# EAGLE schematic Minisumo_V1 (EAGLE 9.6.2)

## Sheet 1 of 6: TOF
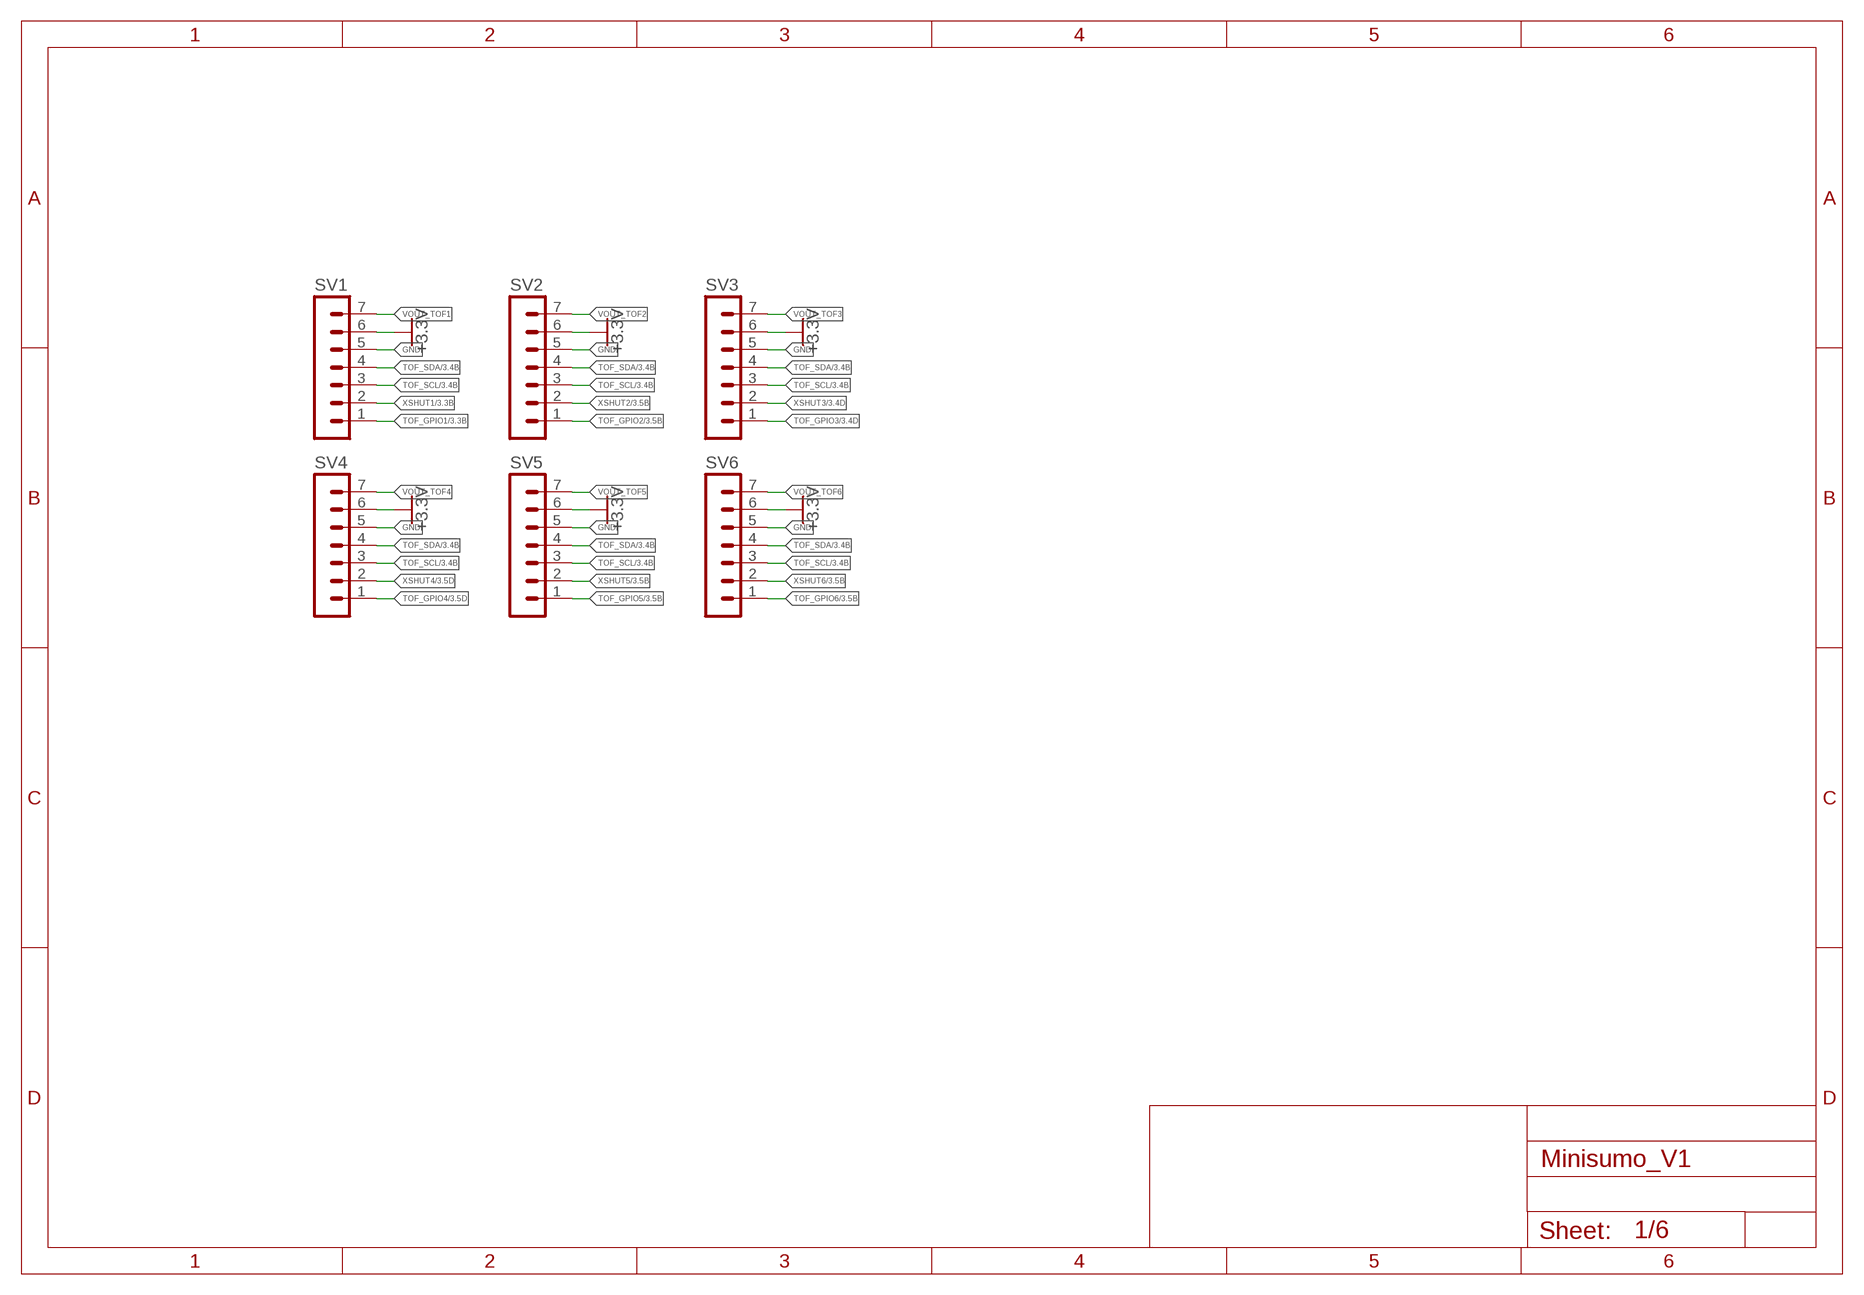
[diagram p0: schematic, sheet 1]

### Parts
SV1  MA07-1  [MA07-1]
SV2  MA07-1  [MA07-1]
SV3  MA07-1  [MA07-1]
SV4  MA07-1  [MA07-1]
SV5  MA07-1  [MA07-1]
SV6  MA07-1  [MA07-1]

### Nets
+3.3V: SV1.6 SV2.6 SV3.6 SV4.6 SV5.6 SV6.6 ; also sheet 2,3,4,5,6
GND: SV1.5 SV2.5 SV3.5 SV4.5 SV5.5 SV6.5 ; also sheet 2,3,4,5,6
TOF_GPIO1: SV1.1 ; also sheet 3
TOF_GPIO2: SV2.1 ; also sheet 3
TOF_GPIO3: SV3.1 ; also sheet 3
TOF_GPIO4: SV4.1 ; also sheet 3
TOF_GPIO5: SV5.1 ; also sheet 3
TOF_GPIO6: SV6.1 ; also sheet 3
TOF_SCL: SV1.3 SV2.3 SV3.3 SV4.3 SV5.3 SV6.3 ; also sheet 3
TOF_SDA: SV1.4 SV2.4 SV3.4 SV4.4 SV5.4 SV6.4 ; also sheet 3
VOUT_TOF1: SV1.7
VOUT_TOF2: SV2.7
VOUT_TOF3: SV3.7
VOUT_TOF4: SV4.7
VOUT_TOF5: SV5.7
VOUT_TOF6: SV6.7
XSHUT1: SV1.2 ; also sheet 3
XSHUT2: SV2.2 ; also sheet 3
XSHUT3: SV3.2 ; also sheet 3
XSHUT4: SV4.2 ; also sheet 3
XSHUT5: SV5.2 ; also sheet 3
XSHUT6: SV6.2 ; also sheet 3

## Sheet 2 of 6: Power
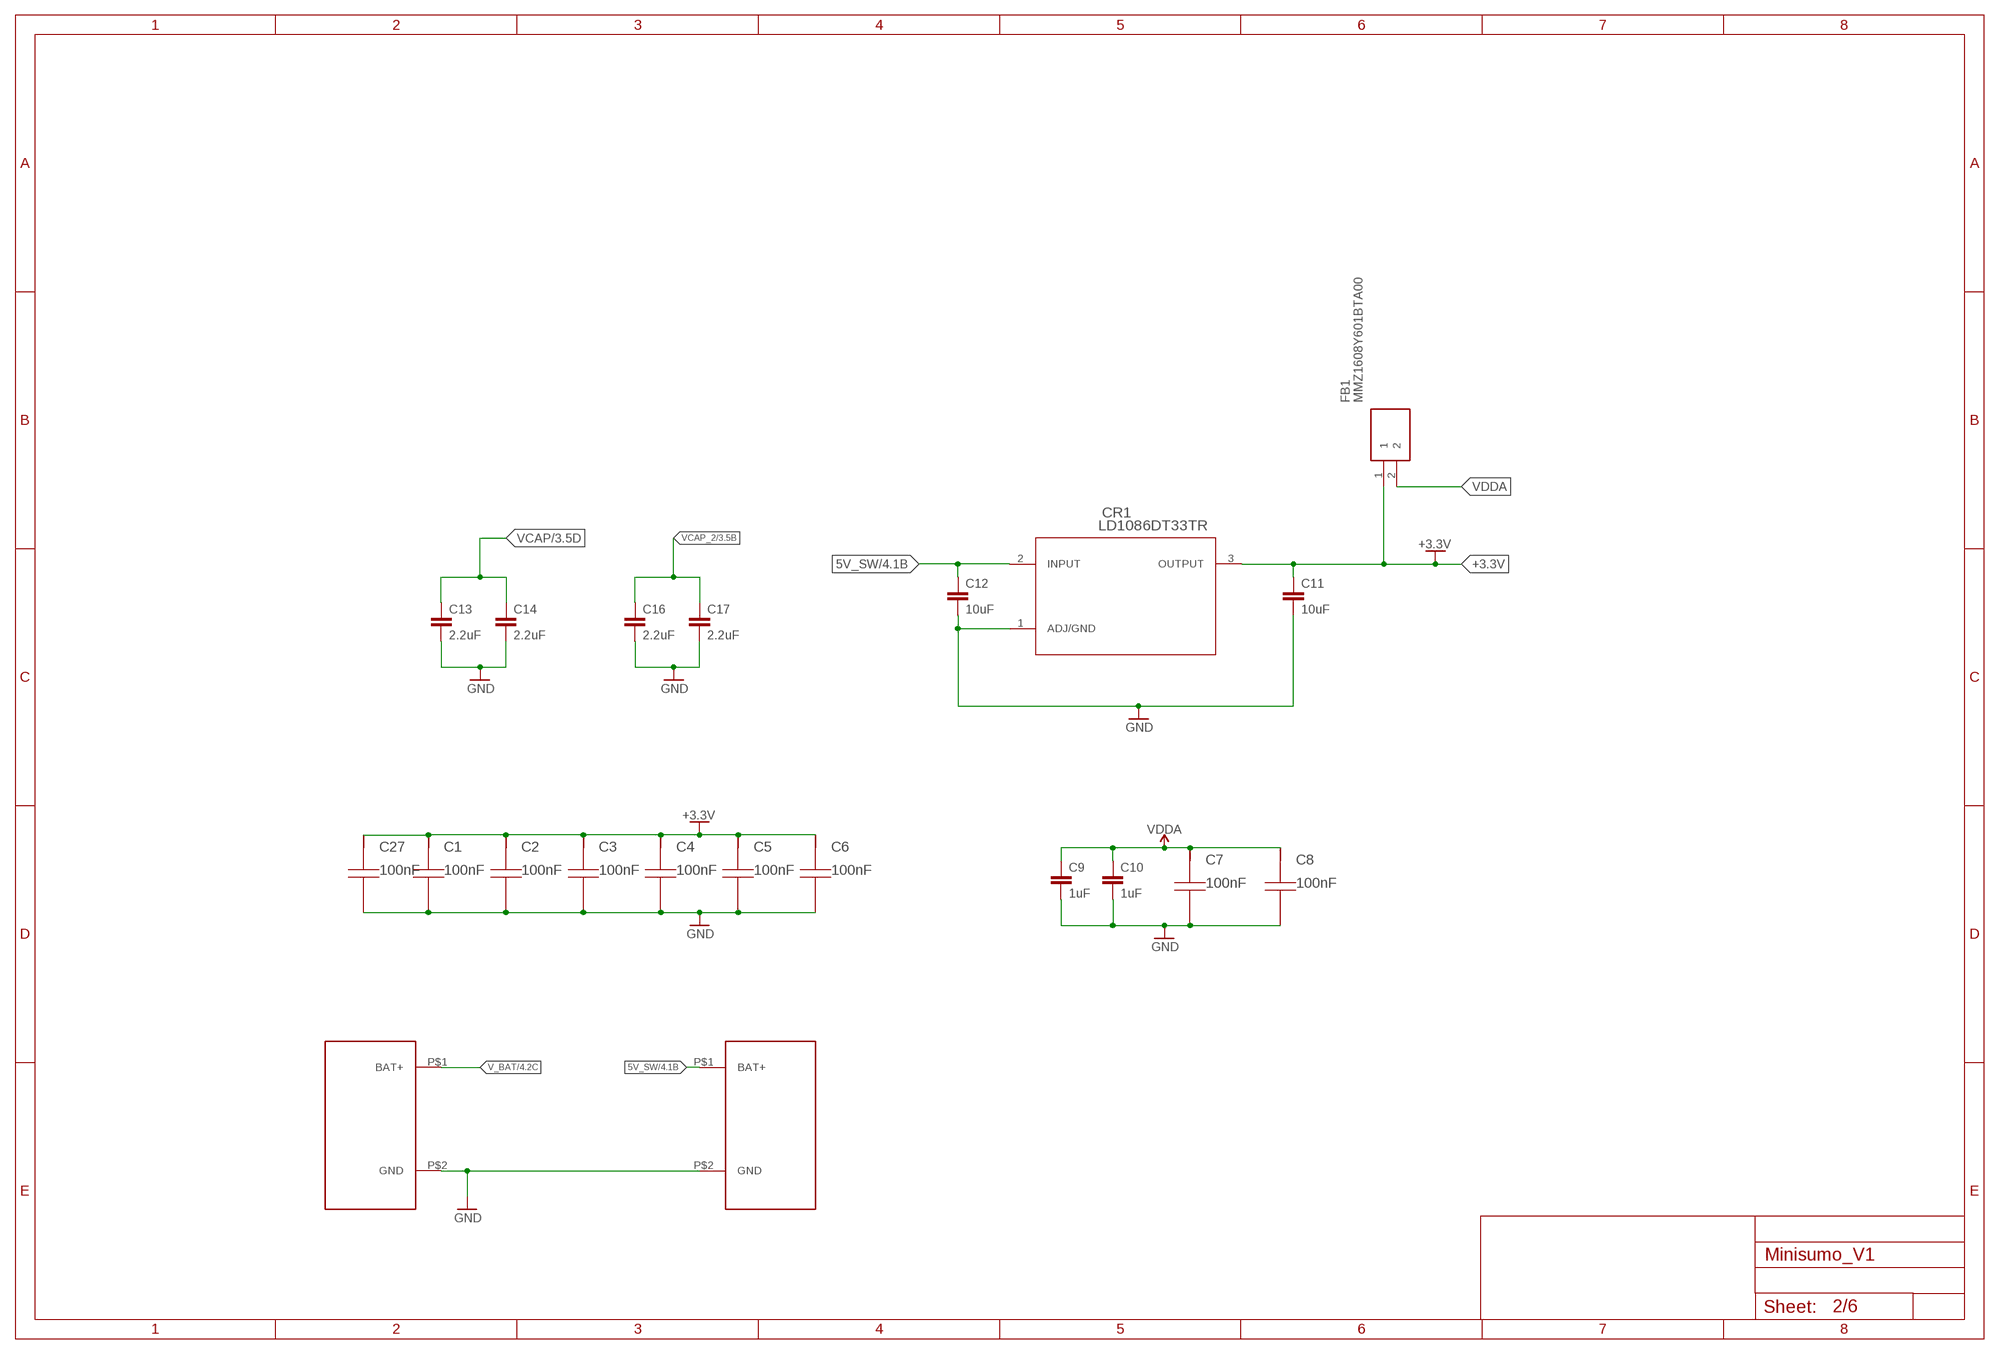
[diagram p1: schematic, sheet 2]

### Parts
C1  100nF  GRM155R71C104KA88D0402  [C0402]
C2  100nF  GRM155R71C104KA88D0402  [C0402]
C3  100nF  GRM155R71C104KA88D0402  [C0402]
C4  100nF  GRM155R71C104KA88D0402  [C0402]
C5  100nF  GRM155R71C104KA88D0402  [C0402]
C6  100nF  GRM155R71C104KA88D0402  [C0402]
C7  100nF  GRM155R71C104KA88D0402  [C0402]
C8  100nF  GRM155R71C104KA88D0402  [C0402]
C9  1uF  C-EUC0402  [C0402]
C10  1uF  C-EUC0402  [C0402]
C11  10uF  C-EUC0603  [C0603]
C12  10uF  C-EUC0603  [C0603]
C13  2.2uF  C-EUC0603  [C0603]
C14  2.2uF  C-EUC0603  [C0603]
C16  2.2uF  C-EUC0603  [C0603]
C17  2.2uF  C-EUC0603  [C0603]
C27  100nF  GRM155R71C104KA88D0402  [C0402]
CR1  LD1086DT33TR  [D2PAK_STM]
FB1  MMZ1608Y601BTA00  [BEADC1608X95N]
U$6  BAT_POW  [BAT_POW]
U$7  BAT_POW  [BAT_POW]

### Nets
5V_SW: C12.1 CR1.2(INPUT) U$7.P$1(BAT+) ; also sheet 4
+3.3V: C1.1 C2.1 C3.1 C4.1 C5.1 C6.1 C11.1 C27.1 CR1.3(OUTPUT) FB1.1 ; also sheet 1,3,4,5,6
GND: C1.2 C2.2 C3.2 C4.2 C5.2 C6.2 C7.2 C8.2 C9.2 C10.2 C11.2 C12.2 C13.2 C14.2 C16.2 C17.2 C27.2 CR1.1(ADJ/GND) U$6.P$2(GND) U$7.P$2(GND) ; also sheet 1,3,4,5,6
V_BAT: U$6.P$1(BAT+) ; also sheet 4
VCAP: C13.1 C14.1 ; also sheet 3
VCAP_2: C16.1 C17.1 ; also sheet 3
VDDA: C7.1 C8.1 C9.1 C10.1 FB1.2 ; also sheet 3

## Sheet 3 of 6: MCU
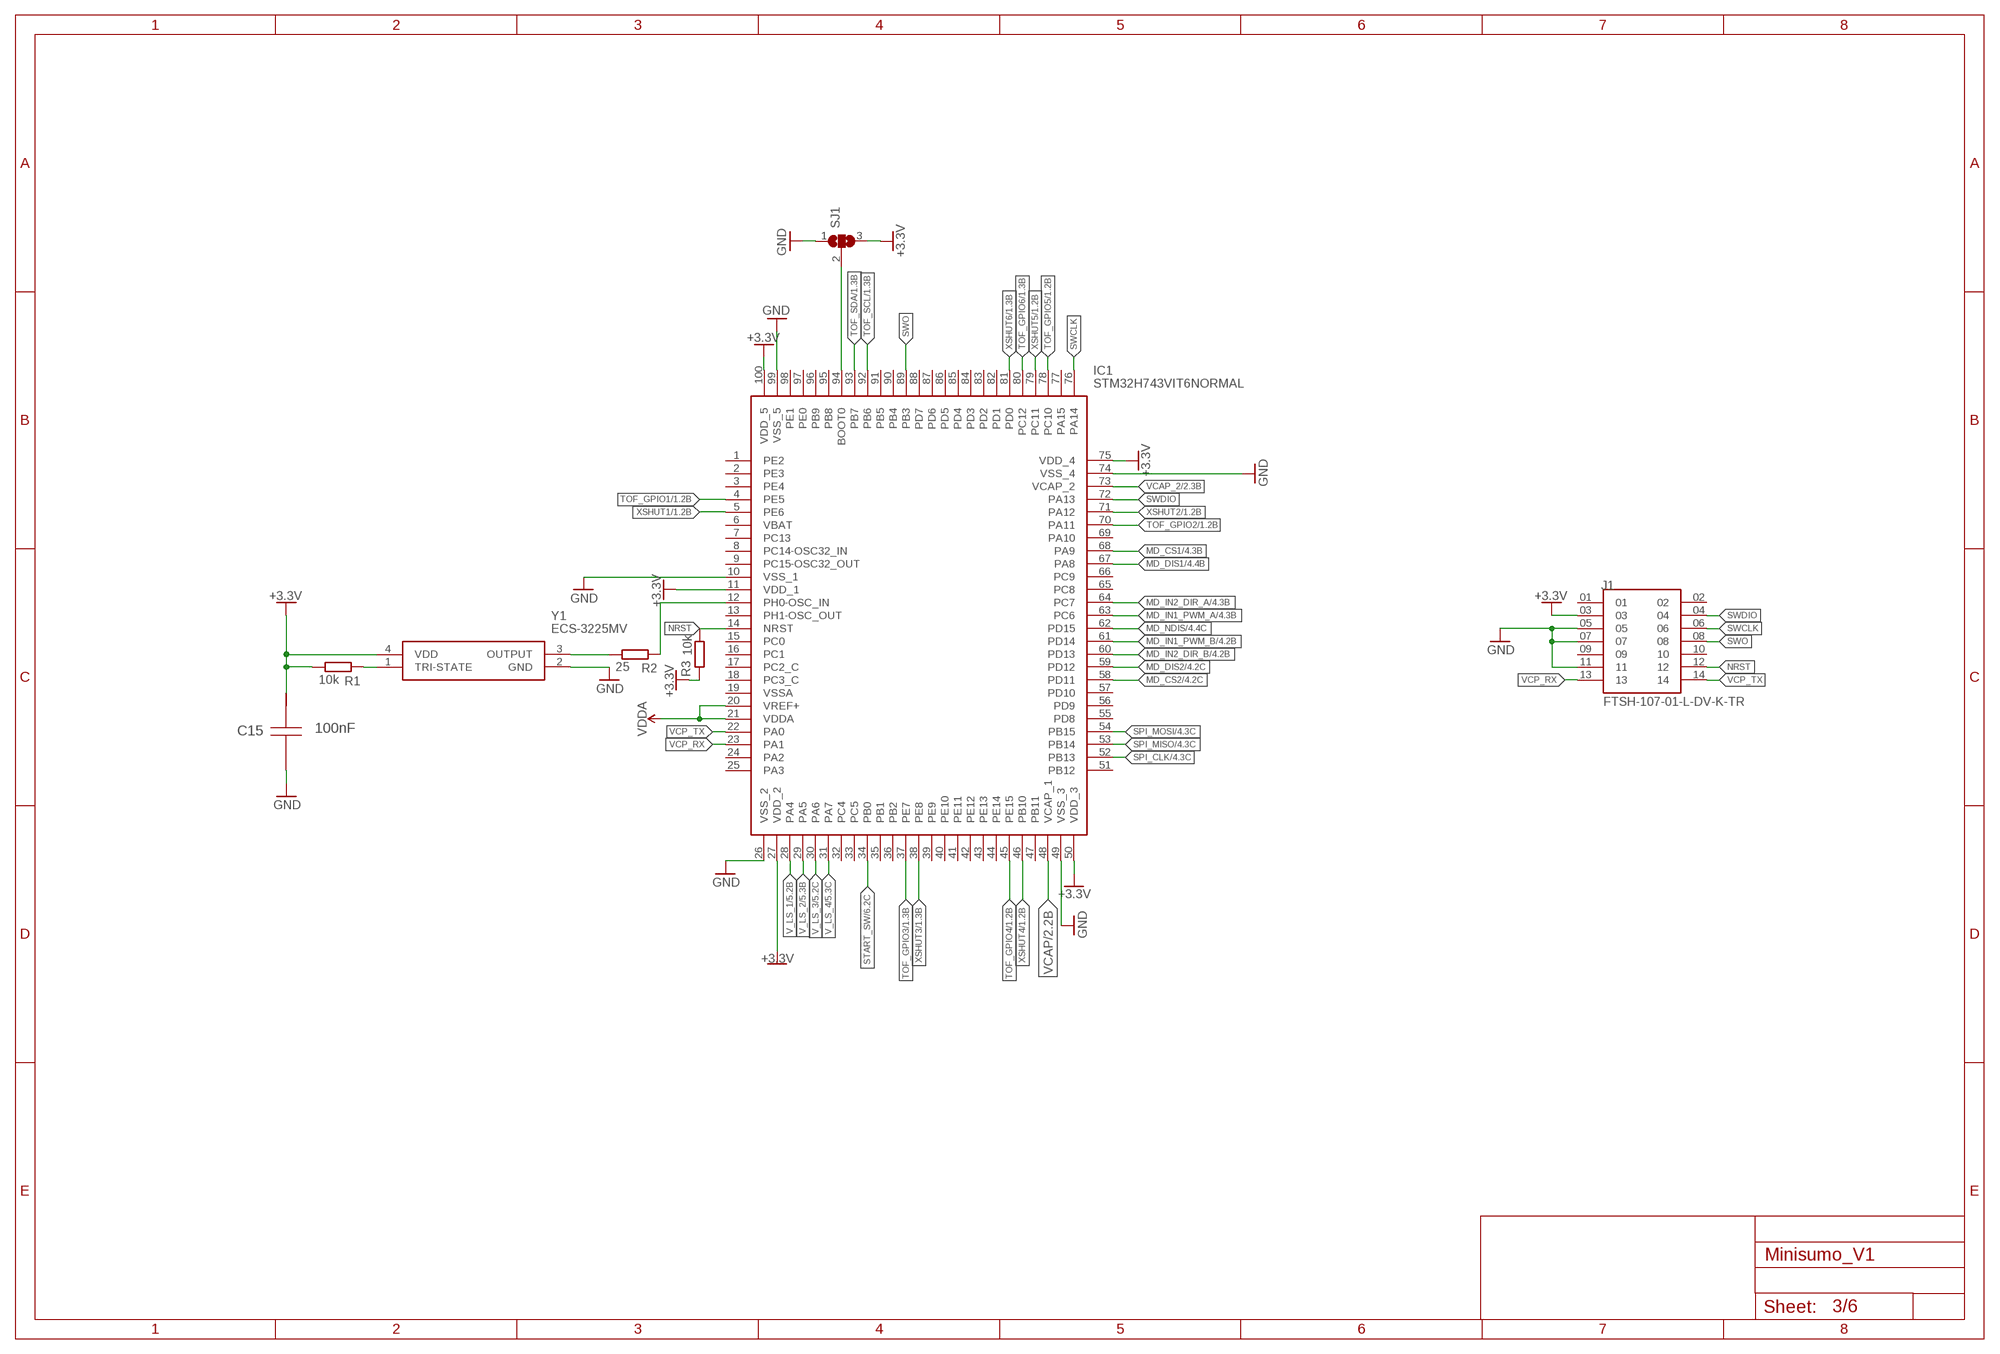
[diagram p2: schematic, sheet 3]

### Parts
C15  100nF  GRM155R71C104KA88D0402  [C0402]
IC1  STM32H743VIT6NORMAL  [QFP50P1600X1600X160-100N]
J1  FTSH-107-01-L-DV-K-TR  [SAMTEC_FTSH-107-01-L-DV-K-TR]
R1  10k  R-EU_R0402  [R0402]
R2  25  R-EU_R0402  [R0402]
R3  10k  R-EU_R0402  [R0402]
SJ1  SJ2W  [SJ_2]
Y1  ECS-3225MV  [ECS3225MV]

### Nets
+3.3V: C15.1 IC1.11(VDD_1) IC1.27(VDD_2) IC1.50(VDD_3) IC1.75(VDD_4) IC1.100(VDD_5) J1.03 R1.1 R3.2 SJ1.3 Y1.4(VDD) ; also sheet 1,2,4,5,6
GND: C15.2 IC1.10(VSS_1) IC1.26(VSS_2) IC1.49(VSS_3) IC1.74(VSS_4) IC1.99(VSS_5) J1.05 J1.07 J1.11 SJ1.1 Y1.2(GND) ; also sheet 1,2,4,5,6
MD_CS1: IC1.68(PA9) ; also sheet 4
MD_CS2: IC1.58(PD11) ; also sheet 4
MD_DIS1: IC1.67(PA8) ; also sheet 4
MD_DIS2: IC1.59(PD12) ; also sheet 4
MD_IN1_PWM_A: IC1.63(PC6) ; also sheet 4
MD_IN1_PWM_B: IC1.61(PD14) ; also sheet 4
MD_IN2_DIR_A: IC1.64(PC7) ; also sheet 4
MD_IN2_DIR_B: IC1.60(PD13) ; also sheet 4
MD_NDIS: IC1.62(PD15) ; also sheet 4
N$1: IC1.94(BOOT0) SJ1.2
N$2: R2.1 Y1.3(OUTPUT)
N$3: R1.2 Y1.1(TRI-STATE)
N$4: IC1.12(PH0-OSC_IN) R2.2
NRST: IC1.14(NRST) J1.12 R3.1
SPI_CLK: IC1.52(PB13) ; also sheet 4
SPI_MISO: IC1.53(PB14) ; also sheet 4
SPI_MOSI: IC1.54(PB15) ; also sheet 4
START_SW: IC1.34(PB0) ; also sheet 6
SWCLK: IC1.76(PA14) J1.06
SWDIO: IC1.72(PA13) J1.04
SWO: IC1.89(PB3) J1.08
TOF_GPIO1: IC1.4(PE5) ; also sheet 1
TOF_GPIO2: IC1.70(PA11) ; also sheet 1
TOF_GPIO3: IC1.37(PE7) ; also sheet 1
TOF_GPIO4: IC1.45(PE15) ; also sheet 1
TOF_GPIO5: IC1.78(PC10) ; also sheet 1
TOF_GPIO6: IC1.80(PC12) ; also sheet 1
TOF_SCL: IC1.92(PB6) ; also sheet 1
TOF_SDA: IC1.93(PB7) ; also sheet 1
V_LS_1: IC1.28(PA4) ; also sheet 5
V_LS_2: IC1.29(PA5) ; also sheet 5
V_LS_3: IC1.30(PA6) ; also sheet 5
V_LS_4: IC1.31(PA7) ; also sheet 5
VCAP: IC1.48(VCAP_1) ; also sheet 2
VCAP_2: IC1.73(VCAP_2) ; also sheet 2
VCP_RX: IC1.23(PA1) J1.13
VCP_TX: IC1.22(PA0) J1.14
VDDA: IC1.20(VREF+) IC1.21(VDDA) ; also sheet 2
XSHUT1: IC1.5(PE6) ; also sheet 1
XSHUT2: IC1.71(PA12) ; also sheet 1
XSHUT3: IC1.38(PE8) ; also sheet 1
XSHUT4: IC1.46(PB10) ; also sheet 1
XSHUT5: IC1.79(PC11) ; also sheet 1
XSHUT6: IC1.81(PD0) ; also sheet 1
Unconnected: IC1.1(PE2) IC1.2(PE3) IC1.3(PE4) IC1.6(VBAT) IC1.7(PC13) IC1.8(PC14-OSC32_IN) IC1.9(PC15-OSC32_OUT) IC1.13(PH1-OSC_OUT) IC1.15(PC0) IC1.16(PC1) IC1.17(PC2_C) IC1.18(PC3_C) IC1.19(VSSA) IC1.24(PA2) IC1.25(PA3) IC1.32(PC4) IC1.33(PC5) IC1.35(PB1) IC1.36(PB2) IC1.39(PE9) IC1.40(PE10) IC1.41(PE11) IC1.42(PE12) IC1.43(PE13) IC1.44(PE14) IC1.47(PB11) IC1.51(PB12) IC1.55(PD8) IC1.56(PD9) IC1.57(PD10) IC1.65(PC8) IC1.66(PC9) IC1.69(PA10) IC1.77(PA15) IC1.82(PD1) IC1.83(PD2) IC1.84(PD3) IC1.85(PD4) IC1.86(PD5) IC1.87(PD6) IC1.88(PD7) IC1.90(PB4) IC1.91(PB5) IC1.95(PB8) IC1.96(PB9) IC1.97(PE0) IC1.98(PE1) J1.01 J1.02 J1.09 J1.10

## Sheet 4 of 6: Motor Control
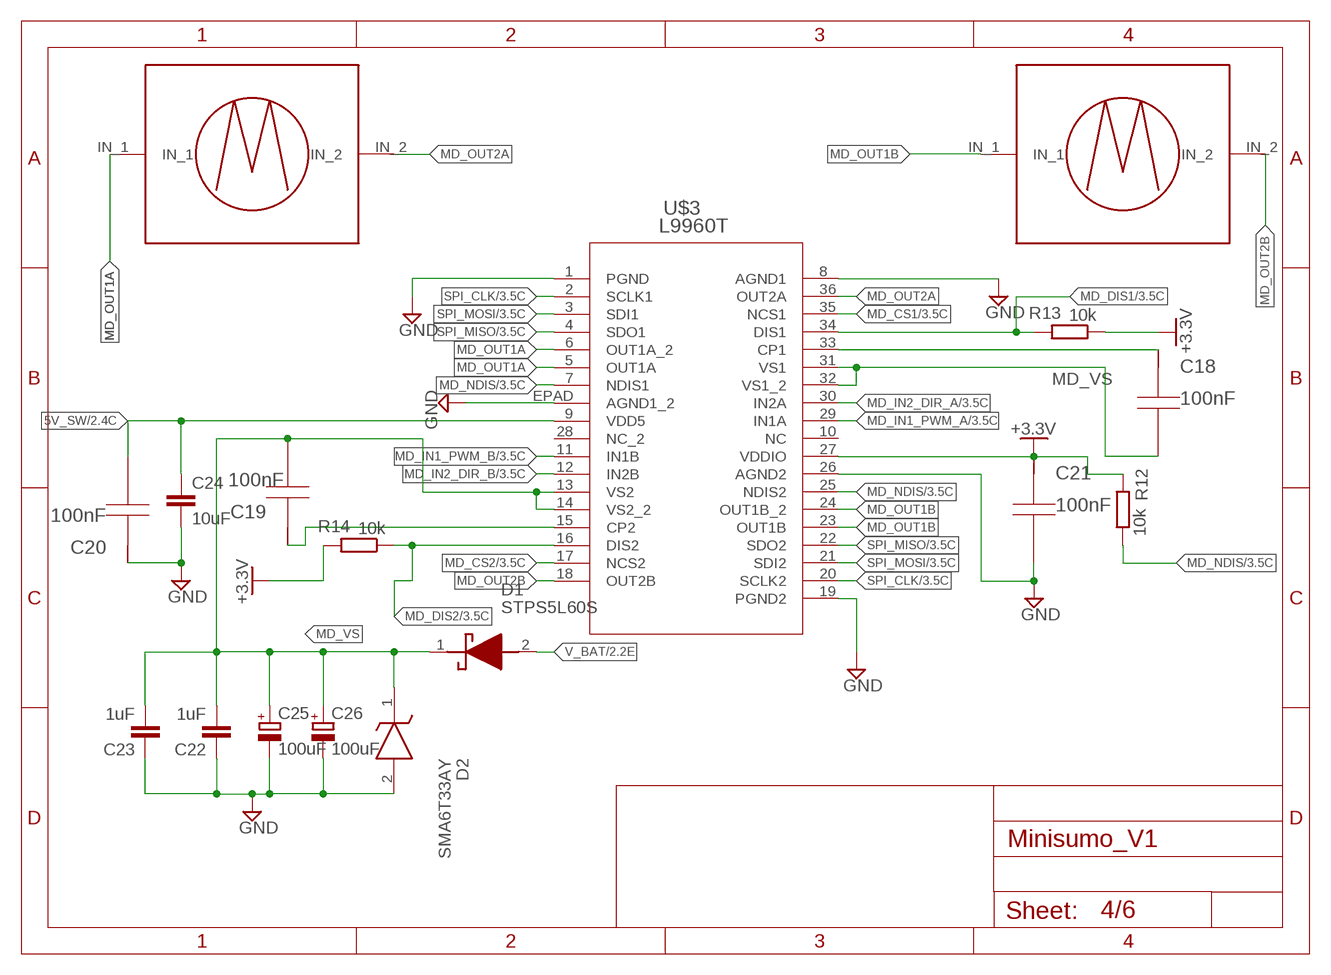
[diagram p3: schematic, sheet 4]

### Parts
C18  100nF  GRM155R71C104KA88D0402  [C0402]
C19  100nF  GRM155R71C104KA88D0402  [C0402]
C20  100nF  GRM155R71C104KA88D0402  [C0402]
C21  100nF  GRM155R71C104KA88D0402  [C0402]
C22  1uF  C-EUC0402  [C0402]
C23  1uF  C-EUC0402  [C0402]
C24  10uF  C-EUC1210  [C1210]
C25  100uF  CPOL-EUUD-8X10  [UD-8X10_NICHICON]
C26  100uF  CPOL-EUUD-8X10  [UD-8X10_NICHICON]
D1  STPS5L60S  [DIOM8059X265N]
D2  SMA6T33AY  [DIOM5126X265N]
R12  10k  R-EU_R0402  [R0402]
R13  10k  R-EU_R0402  [R0402]
R14  10k  R-EU_R0402  [R0402]
U$3  L9960T  [POWERSSO-36_STM]
U$4  MD_OUT  [MD_OUT]
U$5  MD_OUT  [MD_OUT]

### Nets
5V_SW: C20.2 C24.1 U$3.9(VDD5) ; also sheet 2
+3.3V: C21.1 R12.2 R13.1 R14.2 U$3.27(VDDIO) ; also sheet 1,2,3,5,6
GND: C20.1 C21.2 C22.1 C23.1 C24.2 C25.- C26.- D2.2(A) U$3.1(PGND) U$3.8(AGND1) U$3.19(PGND2) U$3.26(AGND2) U$3.EPAD(AGND1_2) ; also sheet 1,2,3,5,6
MD_CS1: U$3.35(NCS1) ; also sheet 3
MD_CS2: U$3.17(NCS2) ; also sheet 3
MD_DIS1: R13.2 U$3.34(DIS1) ; also sheet 3
MD_DIS2: R14.1 U$3.16(DIS2) ; also sheet 3
MD_IN1_PWM_A: U$3.29(IN1A) ; also sheet 3
MD_IN1_PWM_B: U$3.11(IN1B) ; also sheet 3
MD_IN2_DIR_A: U$3.30(IN2A) ; also sheet 3
MD_IN2_DIR_B: U$3.12(IN2B) ; also sheet 3
MD_NDIS: R12.1 U$3.7(NDIS1) U$3.25(NDIS2) ; also sheet 3
MD_OUT1A: U$3.5(OUT1A) U$3.6(OUT1A_2) U$4.IN_1
MD_OUT1B: U$3.23(OUT1B) U$3.24(OUT1B_2) U$5.IN_1
MD_OUT2A: U$3.36(OUT2A) U$4.IN_2
MD_OUT2B: U$3.18(OUT2B) U$5.IN_2
MD_VS: C18.2 C19.2 C22.2 C23.2 C25.+ C26.+ D1.1(K) D2.1(K) U$3.13(VS2) U$3.14(VS2_2) U$3.31(VS1) U$3.32(VS1_2)
N$6: C18.1 U$3.33(CP1)
N$16: C19.1 U$3.15(CP2)
SPI_CLK: U$3.2(SCLK1) U$3.20(SCLK2) ; also sheet 3
SPI_MISO: U$3.4(SDO1) U$3.22(SDO2) ; also sheet 3
SPI_MOSI: U$3.3(SDI1) U$3.21(SDI2) ; also sheet 3
V_BAT: D1.2(A) ; also sheet 2
Unconnected: U$3.10(NC) U$3.28(NC_2)

## Sheet 5 of 6: Line Sensors
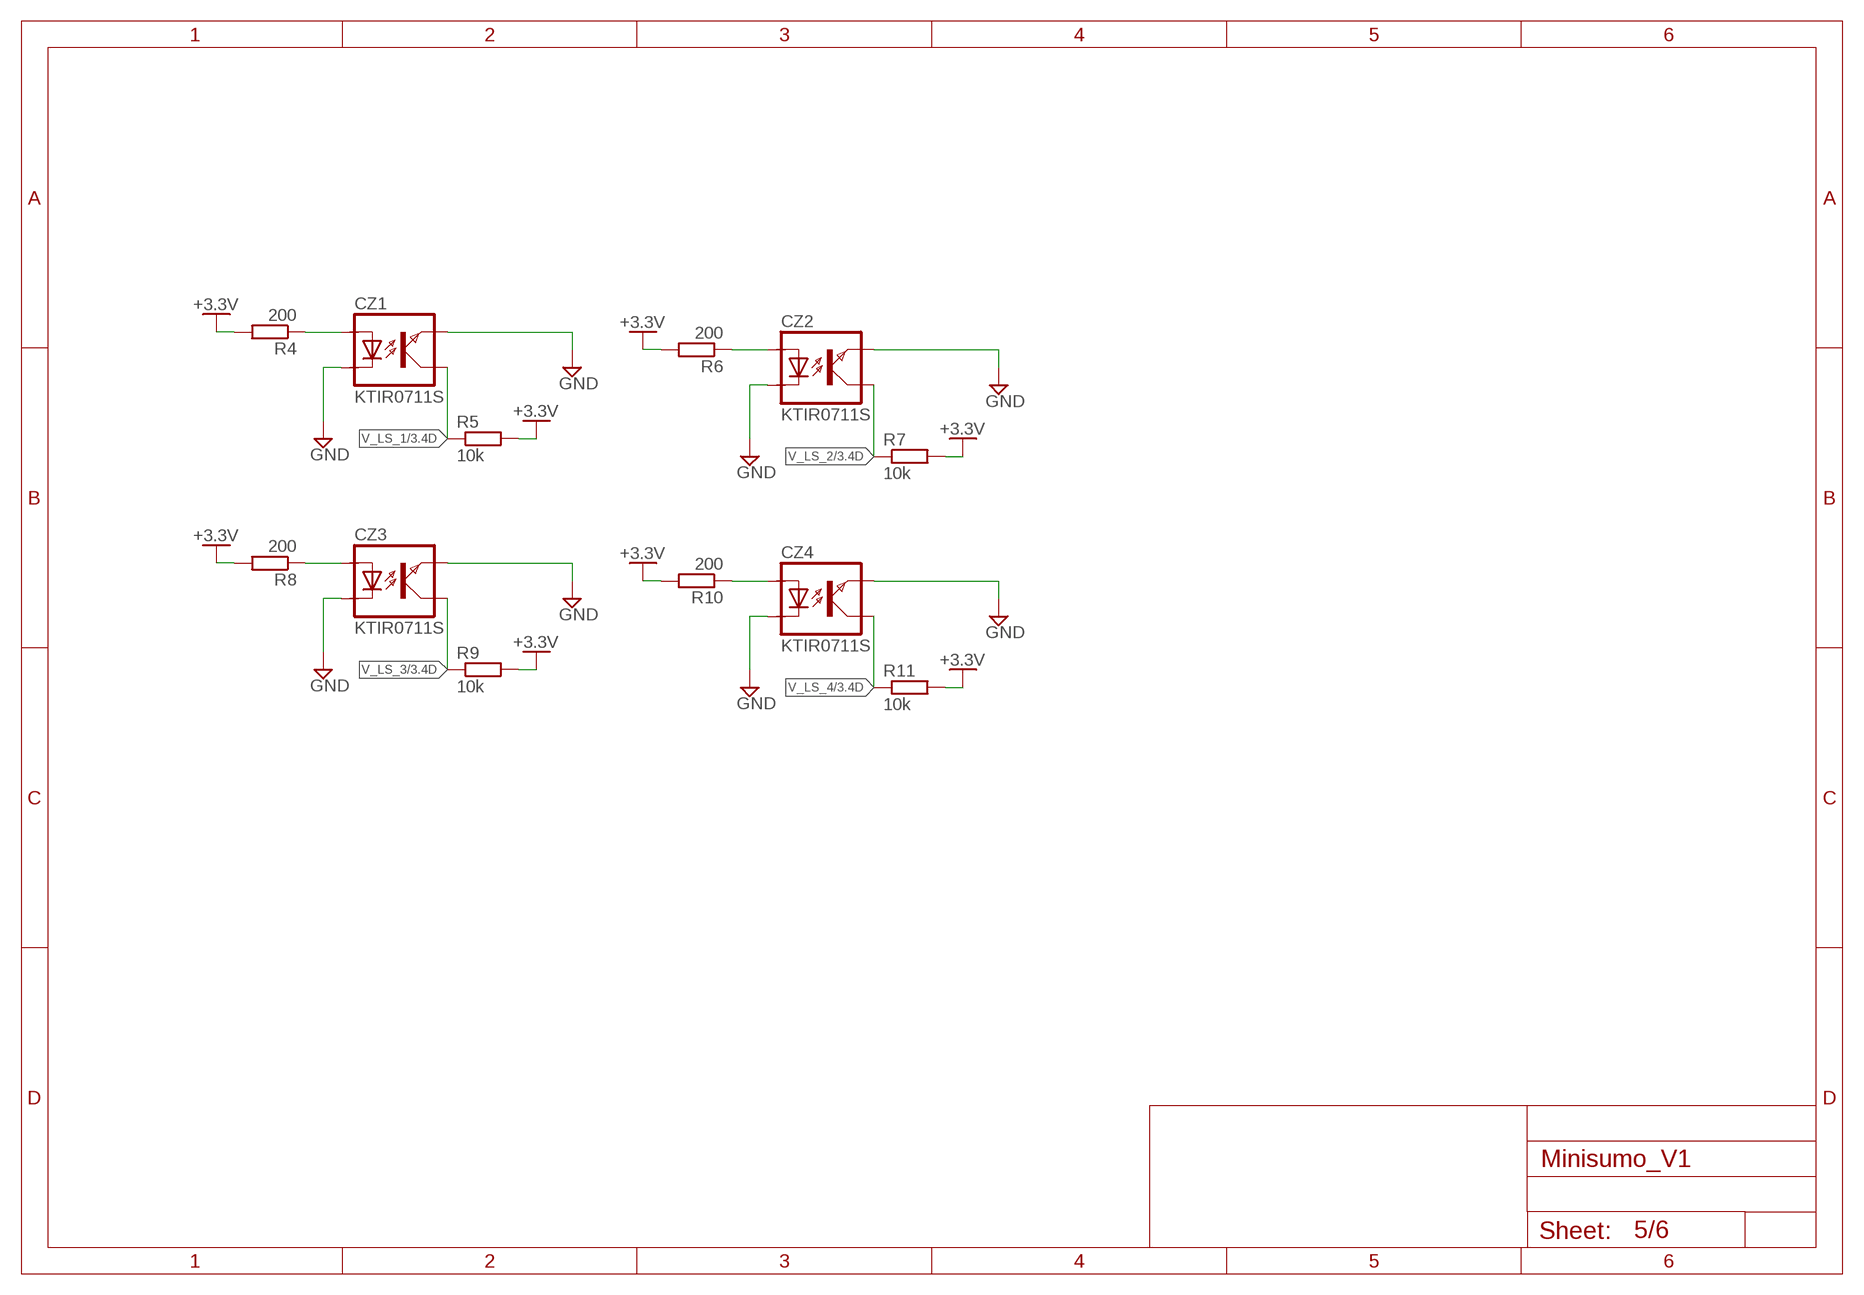
[diagram p4: schematic, sheet 5]

### Parts
CZ1  KTIR0711S  [TOP]
CZ2  KTIR0711S  [TOP]
CZ3  KTIR0711S  [TOP]
CZ4  KTIR0711S  [TOP]
R4  200  R-EU_R0402  [R0402]
R5  10k  R-EU_R0402  [R0402]
R6  200  R-EU_R0402  [R0402]
R7  10k  R-EU_R0402  [R0402]
R8  200  R-EU_R0402  [R0402]
R9  10k  R-EU_R0402  [R0402]
R10  200  R-EU_R0402  [R0402]
R11  10k  R-EU_R0402  [R0402]

### Nets
+3.3V: R4.2 R5.2 R6.2 R7.2 R8.2 R9.2 R10.2 R11.2 ; also sheet 1,2,3,4,6
GND: CZ1.EMITER CZ1.KATODA CZ2.EMITER CZ2.KATODA CZ3.EMITER CZ3.KATODA CZ4.EMITER CZ4.KATODA ; also sheet 1,2,3,4,6
N$8: CZ1.ANODA R4.1
N$9: CZ2.ANODA R6.1
N$10: CZ3.ANODA R8.1
N$11: CZ4.ANODA R10.1
V_LS_1: CZ1.KOLEKTOR R5.1 ; also sheet 3
V_LS_2: CZ2.KOLEKTOR R7.1 ; also sheet 3
V_LS_3: CZ3.KOLEKTOR R9.1 ; also sheet 3
V_LS_4: CZ4.KOLEKTOR R11.1 ; also sheet 3

## Sheet 6 of 6: Starter
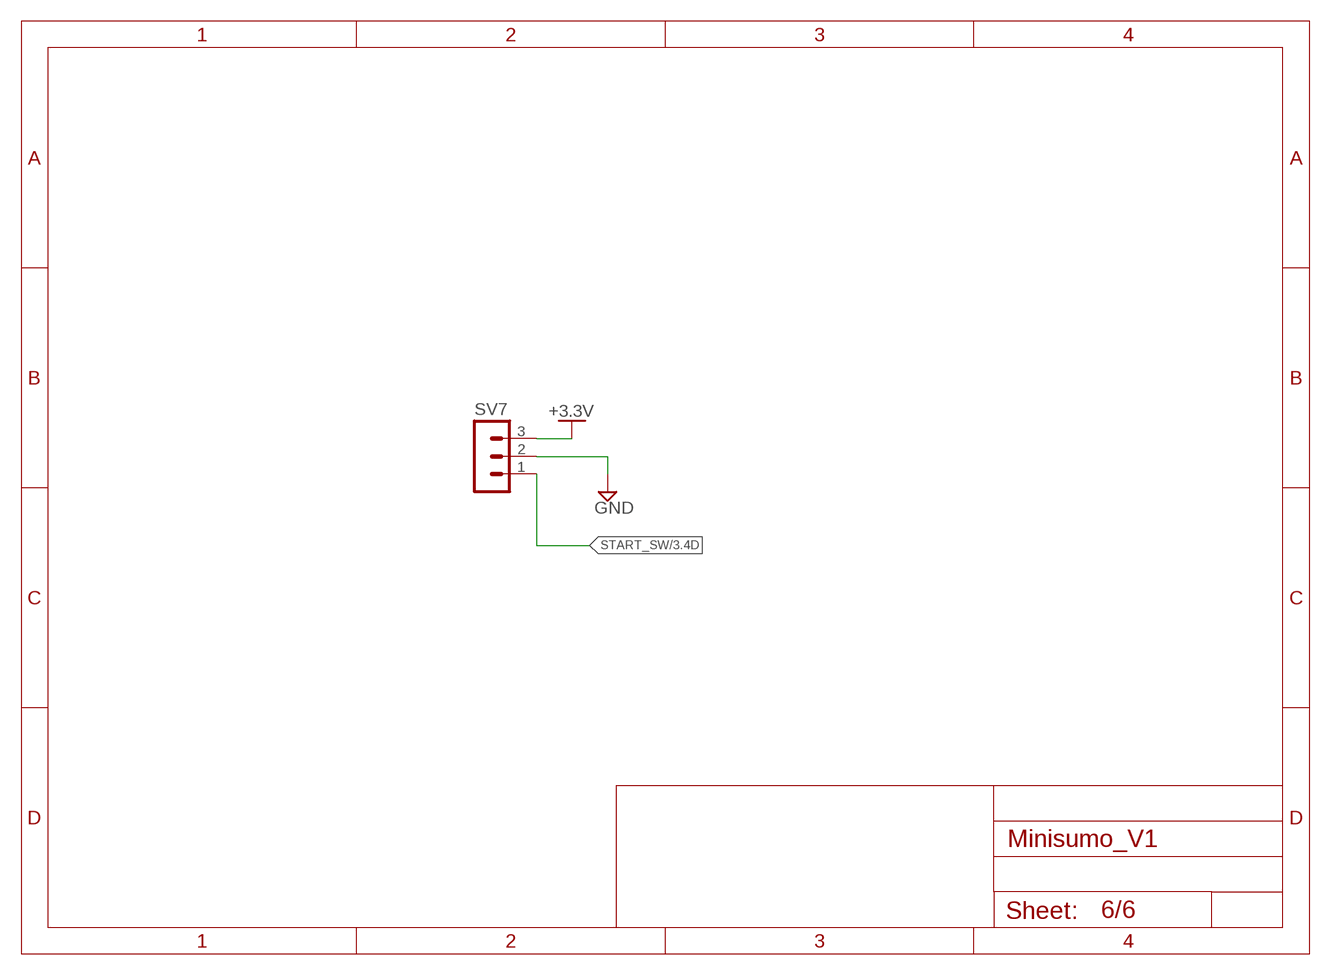
[diagram p5: schematic, sheet 6]

### Parts
SV7  MA03-1  [MA03-1]

### Nets
+3.3V: SV7.3 ; also sheet 1,2,3,4,5
GND: SV7.2 ; also sheet 1,2,3,4,5
START_SW: SV7.1 ; also sheet 3

## Library data of the parts
C1-C8 C15 C18-C21 C27 = AcceleratedDesigns_Lib:GRM155R71C104KA88D
C9 C10 C22 C23 = rcl:C-EU: CAPACITOR, European symbol; MANUFACTURER_PART_NO: EMK105BJ105KV-F; SPICEPREFIX: C; VENDOR: Taiyo Yuden
C11 C12 C14 C17 = rcl:C-EU: CAPACITOR, European symbol; MANUFACTURER_PART_NO: GRM188R61E106KA73D; SPICEPREFIX: C; VENDOR: Murata
C13 C16 = rcl:C-EU: CAPACITOR, European symbol; MANUFACTURER_PART_NO: EMK107BJ225KA-T; SPICEPREFIX: C; VENDOR: Taiyo Yuden
C24 = rcl:C-EU: CAPACITOR, European symbol; MANUFACTURER_PART_NO: UMK325AB7106KMHP; SPICEPREFIX: C
C25 C26 = rcl:CPOL-EU: POLARIZED CAPACITOR, European symbol; MANUFACTURER_PART_NO: RVT1H101M0810; SPICEPREFIX: C
CR1 = ST_Power:LD1086DT33TR; COPYRIGHT: Copyright (C) 2021 Ultra Librarian. All rights reserved.; MANUFACTURER_PART_NUMBER: LD1086DT33TR; MFR_NAME: STMicroelectronics
CZ1-CZ4 = KTIR0711S:KTIR0711S; MANUFACTURER_PART_NO: ITR8307/S18/TR8(B)
D1 = SamacSys_Parts:STPS5L60S: STMicroelectronics STPS5L60S, SMT Schottky Diode, 60V 5A, 2-Pin DO-214AB Source: Datasheet <https://componentsearchengine.com/Datasheets/2/STPS5L60S.pdf>; DESCRIPTION: STMicroelectronics STPS5L60S, SMT Schottky Diode, 60V 5A, 2-Pin DO-214AB; HEIGHT: 2.65mm; MANUFACTURER_NAME: STMicroelectronics; MANUFACTURER_PART_NUMBER: STPS5L60S; MOUSER_PART_NUMBER: 511-STPS5L60S; MOUSER_PRICE-STOCK: https://www.mouser.co.uk/ProductDetail/STMicroelectronics/STPS5L60S?qs=%252BB84zevwoRCxtciFC%252BzmMw%3D%3D
D2 = SamacSys_Parts:SMA6T33AY: ESD Suppressors / TVS Diodes 600W 4kW Transil SMA 5V to 70V Uni Source: Datasheet <http://www.st.com/content/ccc/resource/technical/document/datasheet/93/f7/c5/38/17/3c/42/37/CD00283518.pdf/files/CD00283518.pdf/_jcr_content/translations/en.CD00283518.pdf>; DESCRIPTION: ESD Suppressors / TVS Diodes 600W 4kW Transil SMA 5V to 70V Uni; HEIGHT: 2.65mm; MANUFACTURER_NAME: STMicroelectronics; MANUFACTURER_PART_NUMBER: SMA6T33AY; MOUSER_PART_NUMBER: 511-SMA6T33AY; MOUSER_PRICE-STOCK: https://www.mouser.co.uk/ProductDetail/STMicroelectronics/SMA6T33AY?qs=NW1tGwZwExGor%2FvZVbtWhA%3D%3D
FB1 = SamacSys_Parts:MMZ1608Y601BTA00: TDK - MMZ1608Y601BTA00 - Ferrite Bead, 0603 [1608 Metric], 600 ohm, 500 mA, MMZ Series, 0.4 ohm, +/- 25% Source: Datasheet <https://product.tdk.com/system/files/dam/doc/product/emc/emc/beads/catalog/beads_commercial_signal_mmz1608_en.pdf>; DESCRIPTION: TDK - MMZ1608Y601BTA00 - Ferrite Bead, 0603 [1608 Metric], 600 ohm, 500 mA, MMZ Series, 0.4 ohm, +/- 25%; HEIGHT: 0.95mm; MANUFACTURER_NAME: TDK; MANUFACTURER_PART_NUMBER: MMZ1608Y601BTA00; MOUSER_PART_NUMBER: 810-MMZ1608Y601BTA00; MOUSER_PRICE-STOCK: https://www.mouser.co.uk/ProductDetail/TDK/MMZ1608Y601BTA00?qs=pLY5GE0xrmIZFSJpXFN%252BVg%3D%3D
IC1 = SamacSys_Parts:STM32H743VIT6: ARM Microcontrollers - MCU High-performance and DSP with DP-FPU, ARM Cortex-M7 MCU with 2MBytes Flash, 1MB RAM, 400 MHz CPU, Art Accelerator, L1 cache, external memory interface, large set of peripherals Source: Datasheet <https://www.st.com/resource/en/datasheet/stm32h743vi.pdf>
J1 = FTSH-107-01-L-DV-K-TR:FTSH-107-01-L-DV-K-TR; MANUFACTURER: Samtec; PARTREV: R; STANDARD: Manufacturer Recommendations
R1-R14 = rcl:R-EU_: RESISTOR, European symbol; SPICEPREFIX: R
SJ1 = jumper:SJ2W: SMD solder JUMPER
SV1-SV6 = con-lstb:MA07-1: PIN HEADER; OC_FARNELL: unknown; OC_NEWARK: unknown
SV7 = con-lstb:MA03-1: PIN HEADER; OC_FARNELL: unknown; OC_NEWARK: unknown
U$3 = l9960:L9960T
U$4 U$5 = SamacSys_Parts:MD_OUT
U$6 U$7 = SamacSys_Parts:BAT_POW
Y1 = ECS-3225MV:ECS-3225MV: 24MHz XO (Standard) HCMOS Oscillator 1.62V ~ 3.63V Enable/Disable 4-SMD, No Lead Source: Datasheet <https://ecsxtal.com/store/pdf/ECS-3225MV.pdf>; DESCRIPTION: 24MHz XO (Standard) HCMOS Oscillator 1.62V ~ 3.63V Enable/Disable 4-SMD, No Lead; HEIGHT: 1.2mm; MANUFACTURER_NAME: ECS; MANUFACTURER_PART_NUMBER: ECS-3225MV

## Net classes
1 usb_diff: width 0.127 mm